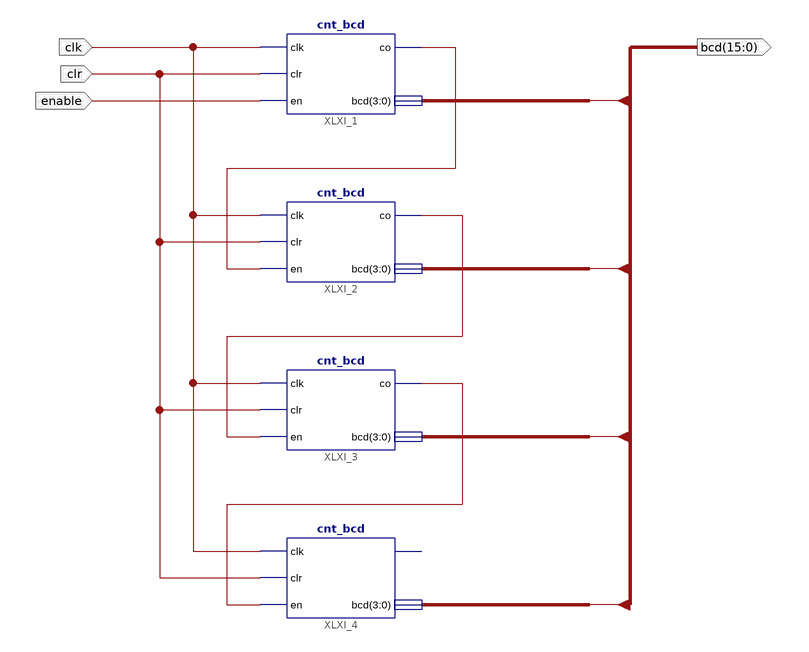
[diagram p0: schematic sheet 1]
// Xilinx ISE schematic bcd_cnt_4x1.sch (spartan3e) as structural Verilog: 4 symbols, 4 ports
module bcd_cnt_4x1 (
  input  clr,
  input  clk,
  input  enable,
  output [15:0] bcd
);

  wire XLXN_1, XLXN_2, XLXN_3;

  cnt_bcd XLXI_1 (.clk(clk), .clr(clr), .en(enable), .co(XLXN_3), .bcd(bcd[3:0]));
  cnt_bcd XLXI_2 (.clk(clk), .clr(clr), .en(XLXN_3), .co(XLXN_2), .bcd(bcd[7:4]));
  cnt_bcd XLXI_3 (.clk(clk), .clr(clr), .en(XLXN_2), .co(XLXN_1), .bcd(bcd[11:8]));
  cnt_bcd XLXI_4 (.clk(clk), .clr(clr), .en(XLXN_1), .bcd(bcd[15:12]));  // open: co
endmodule
